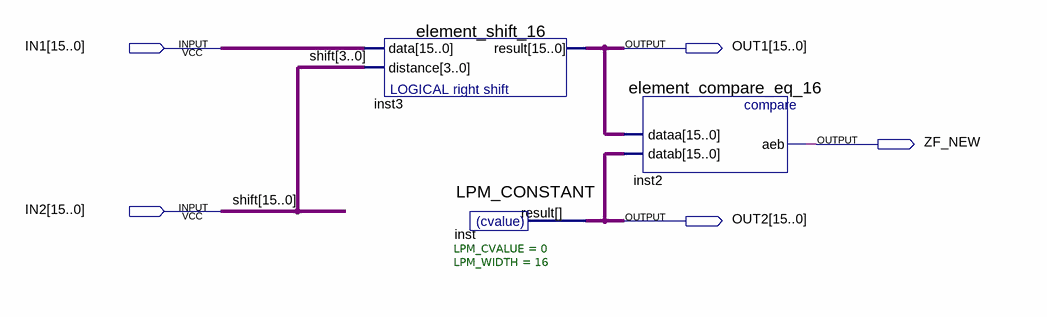
[diagram p0: schematic sheet]
// Quartus schematic block-operation-variant-srl.bdf as structural Verilog: 3 symbols, 5 pins
module \block-operation-variant-srl  (
  input  [15:0] IN1,
  input  [15:0] IN2,
  output [15:0] OUT1,
  output ZF_NEW,
  output [15:0] OUT2
);

  element_shift_16 inst3 (.data(IN1), .distance(IN2[3:0]), .result(OUT1));
  LPM_CONSTANT #(.LPM_CVALUE(0), .LPM_WIDTH(16)) inst (.result(OUT2));
  element_compare_eq_16 inst2 (.dataa(OUT1), .datab(OUT2), .aeb(ZF_NEW));

  // Other names for the same wires on the sheet: shift[15:0] = IN2
endmodule
